# Altium schematic sheet Schematic_shield_Rovables_v2.SchDoc: Programming Adapter Shield
size A; Author: Artem Dementyev; Revision: 2; Designer: Artem Dementyev
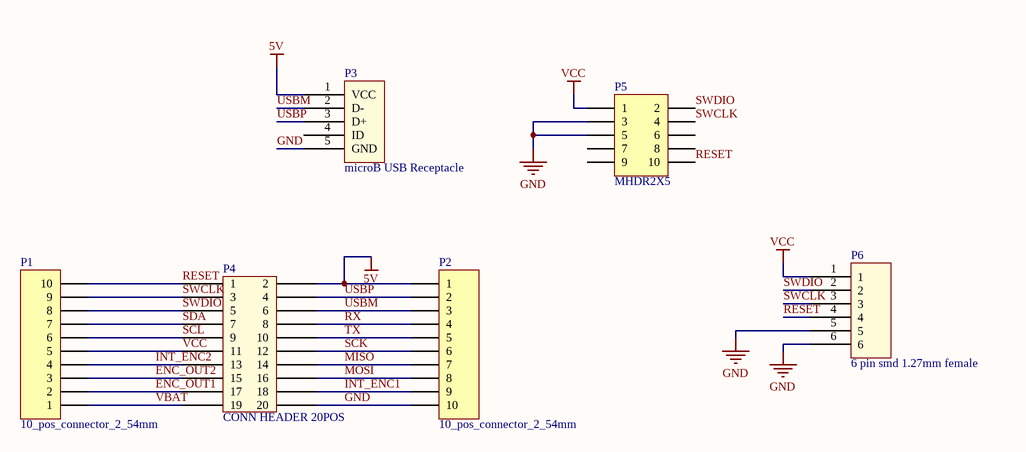
[diagram p0: Schematic_shield_Rovables_v2.SchDoc]

## Parts
P1  10_pos_connector_2_54mm  [2_54mm_10_pos_connector]
P2  10_pos_connector_2_54mm  [2_54mm_10_pos_connector]
P3  microB USB Receptacle  [MicroB USB Standarad SMT]
P4  CONN HEADER 20POS  [DF12 20 POS]
P5  MHDR2X5  [MHDR2X5]
P6  6 pin smd 1.27mm female  [6pos 1.27mm]

## Nets
5V: P2.1 P3.1(VCC) P4.2
GND: P2.10 P3.5(GND) P4.20 P5.3 P5.5 P6.5 P6.6
VCC: P1.5 P4.11 P5.1 P6.1
ENC_OUT1: P1.2 P4.17
ENC_OUT2: P1.3 P4.15
INT_ENC1: P2.9 P4.18
INT_ENC2: P1.4 P4.13
MISO: P2.7 P4.14
MOSI: P2.8 P4.16
RESET: P1.10 P4.1 P5.10 P6.4
RX: P2.4 P4.8
SCK: P2.6 P4.12
SCL: P1.6 P4.9
SDA: P1.7 P4.7
SWCLK: P1.9 P4.3 P5.4 P6.3
SWDIO: P1.8 P4.5 P5.2 P6.2
TX: P2.5 P4.10
USBM: P2.3 P3.2(D-) P4.6
USBP: P2.2 P3.3(D+) P4.4
VBAT: P1.1 P4.19

Not connected (* = marked no-connect by the designer): P3 4(ID); P5 6 7 8 9

## Notes on the sheet
- Title
- Designed by
- Ver
- Date:
- Time:

## Library data of the parts
P3 = microB USB Receptacle: Manufacturer: ZX62-B-5PA(11); Digikey: H11634CT-ND; digikey part number 2: 609-4613-1-ND
P4 = CONN HEADER 20POS: manufacturer part number: DF12D(4.0)-20DP-0.5V(81); manufacturer: Hirose Electric Co Ltd; digikey part number: H11743CT-ND; Supplier 1: Digi-Key; Supplier Part Number 1: H11743CT-ND
P5 = MHDR2X5: Header, 5-Pin, Dual row; LatestRevisionDate: 17-Jul-2002; LatestRevisionNote: Re-released for DXP Platform.; Publisher: Altium Limited
P6 = 6 pin smd 1.27mm female: digikey: S9005E-06-ND